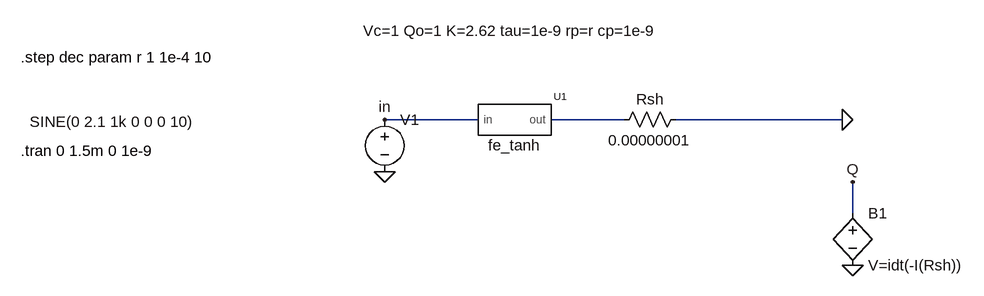
[diagram p0: schematic Fe_test.asc]
Fe_test.asc, the LTspice schematic file:
Version 4
SHEET 1 880 680
WIRE -208 -16 -352 -16
WIRE 16 -16 -96 -16
WIRE 352 -16 96 -16
WIRE 368 128 368 80
FLAG 352 -16 0
FLAG -352 64 0
FLAG 368 208 0
FLAG 368 80 Q
FLAG -352 -16 in
SYMBOL voltage -352 -32 R0
WINDOW 123 0 0 Left 0
WINDOW 39 0 0 Left 0
WINDOW 3 -546 19 Left 2
SYMATTR Value SINE(0 2.1 1k 0 0 0 10)
SYMATTR InstName V1
SYMBOL res 112 -32 R90
WINDOW 0 0 56 VBottom 2
WINDOW 3 32 56 VTop 2
SYMATTR InstName Rsh
SYMATTR Value 0.00000001
SYMBOL bv 368 112 R0
SYMATTR InstName B1
SYMATTR Value V=idt(-I(Rsh))
SYMBOL fe_tanh -160 -16 R0
WINDOW 39 3 -152 Top 2
SYMATTR SpiceLine Vc=1 Qo=1 K=2.62 tau=1e-9 rp=r cp=1e-9
SYMATTR InstName U1
TEXT -912 32 Left 2 !.tran 0 1.5m 0 1e-9
TEXT -912 -112 Left 2 !.step dec param r 1 1e-4 10

The netlist it stands for:
* Fe_test.asc
V1 in 0 SINE(0 2.1 1k 0 0 0 10)
Rsh 0 N001 0.00000001
B1 Q 0 V=idt(-I(Rsh))
XU1 in N001 fe_tanh Vc=1 Qo=1 K=2.62 tau=1e-9 rp=r cp=1e-9  ; pins in out
.tran 0 1.5m 0 1e-9
.step dec param r 1 1e-4 10
.lib C:\Users\MBX\Desktop\Investigacion\Spice-LK-Model\Fe_model\fe_tanh_ni.sp
.backanno
.end